# EAGLE schematic A10kalsch (EAGLE 6.5.0)
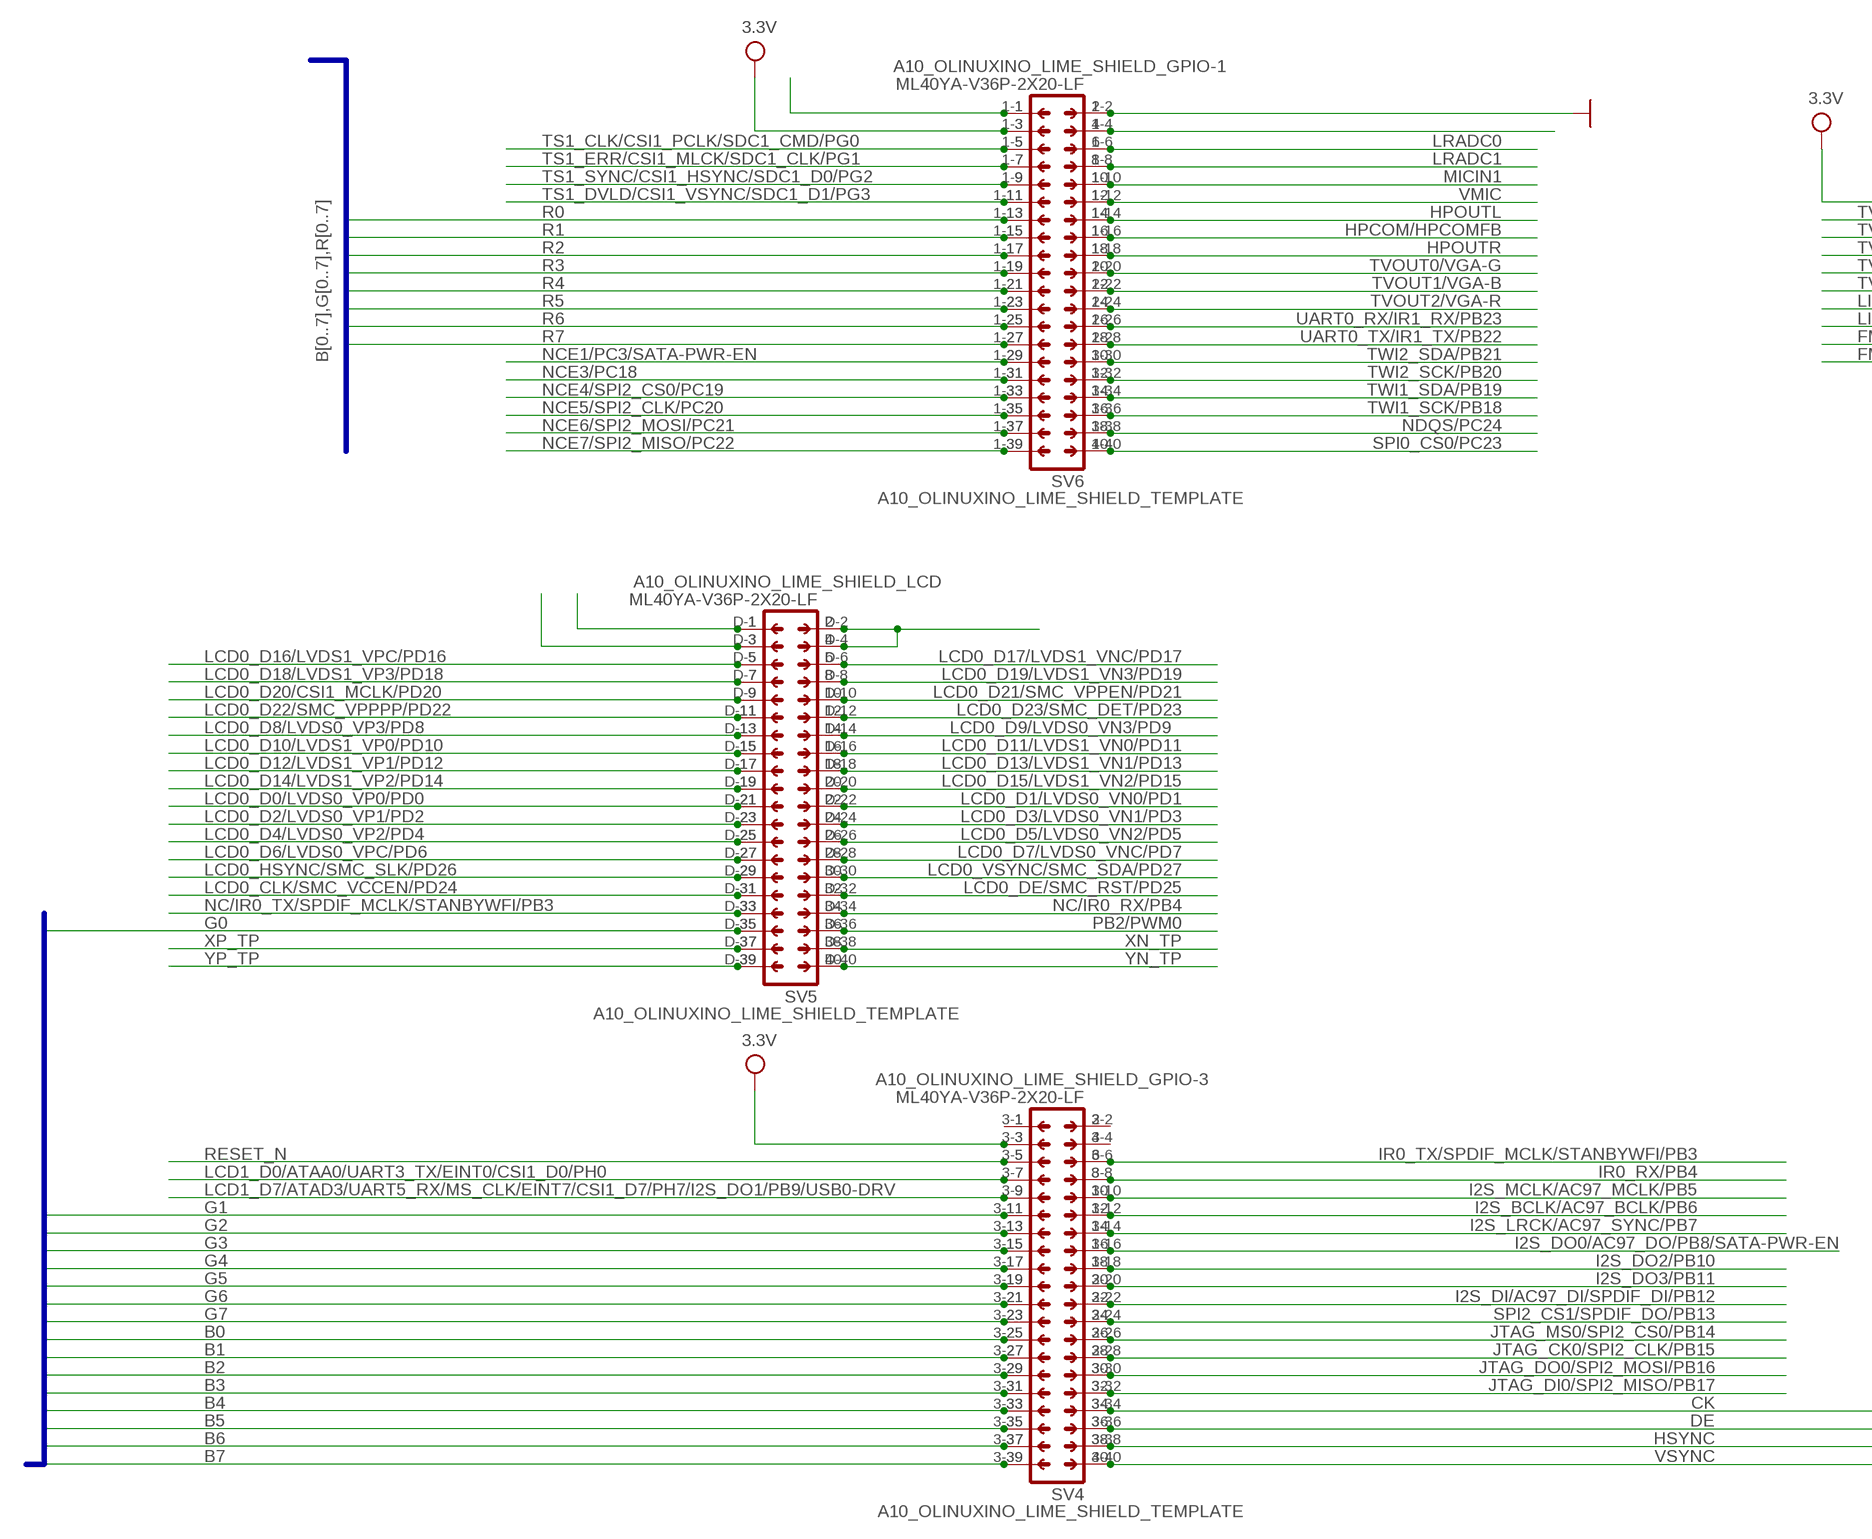
[diagram p0: schematic, sheet 1, part 1 of 2]
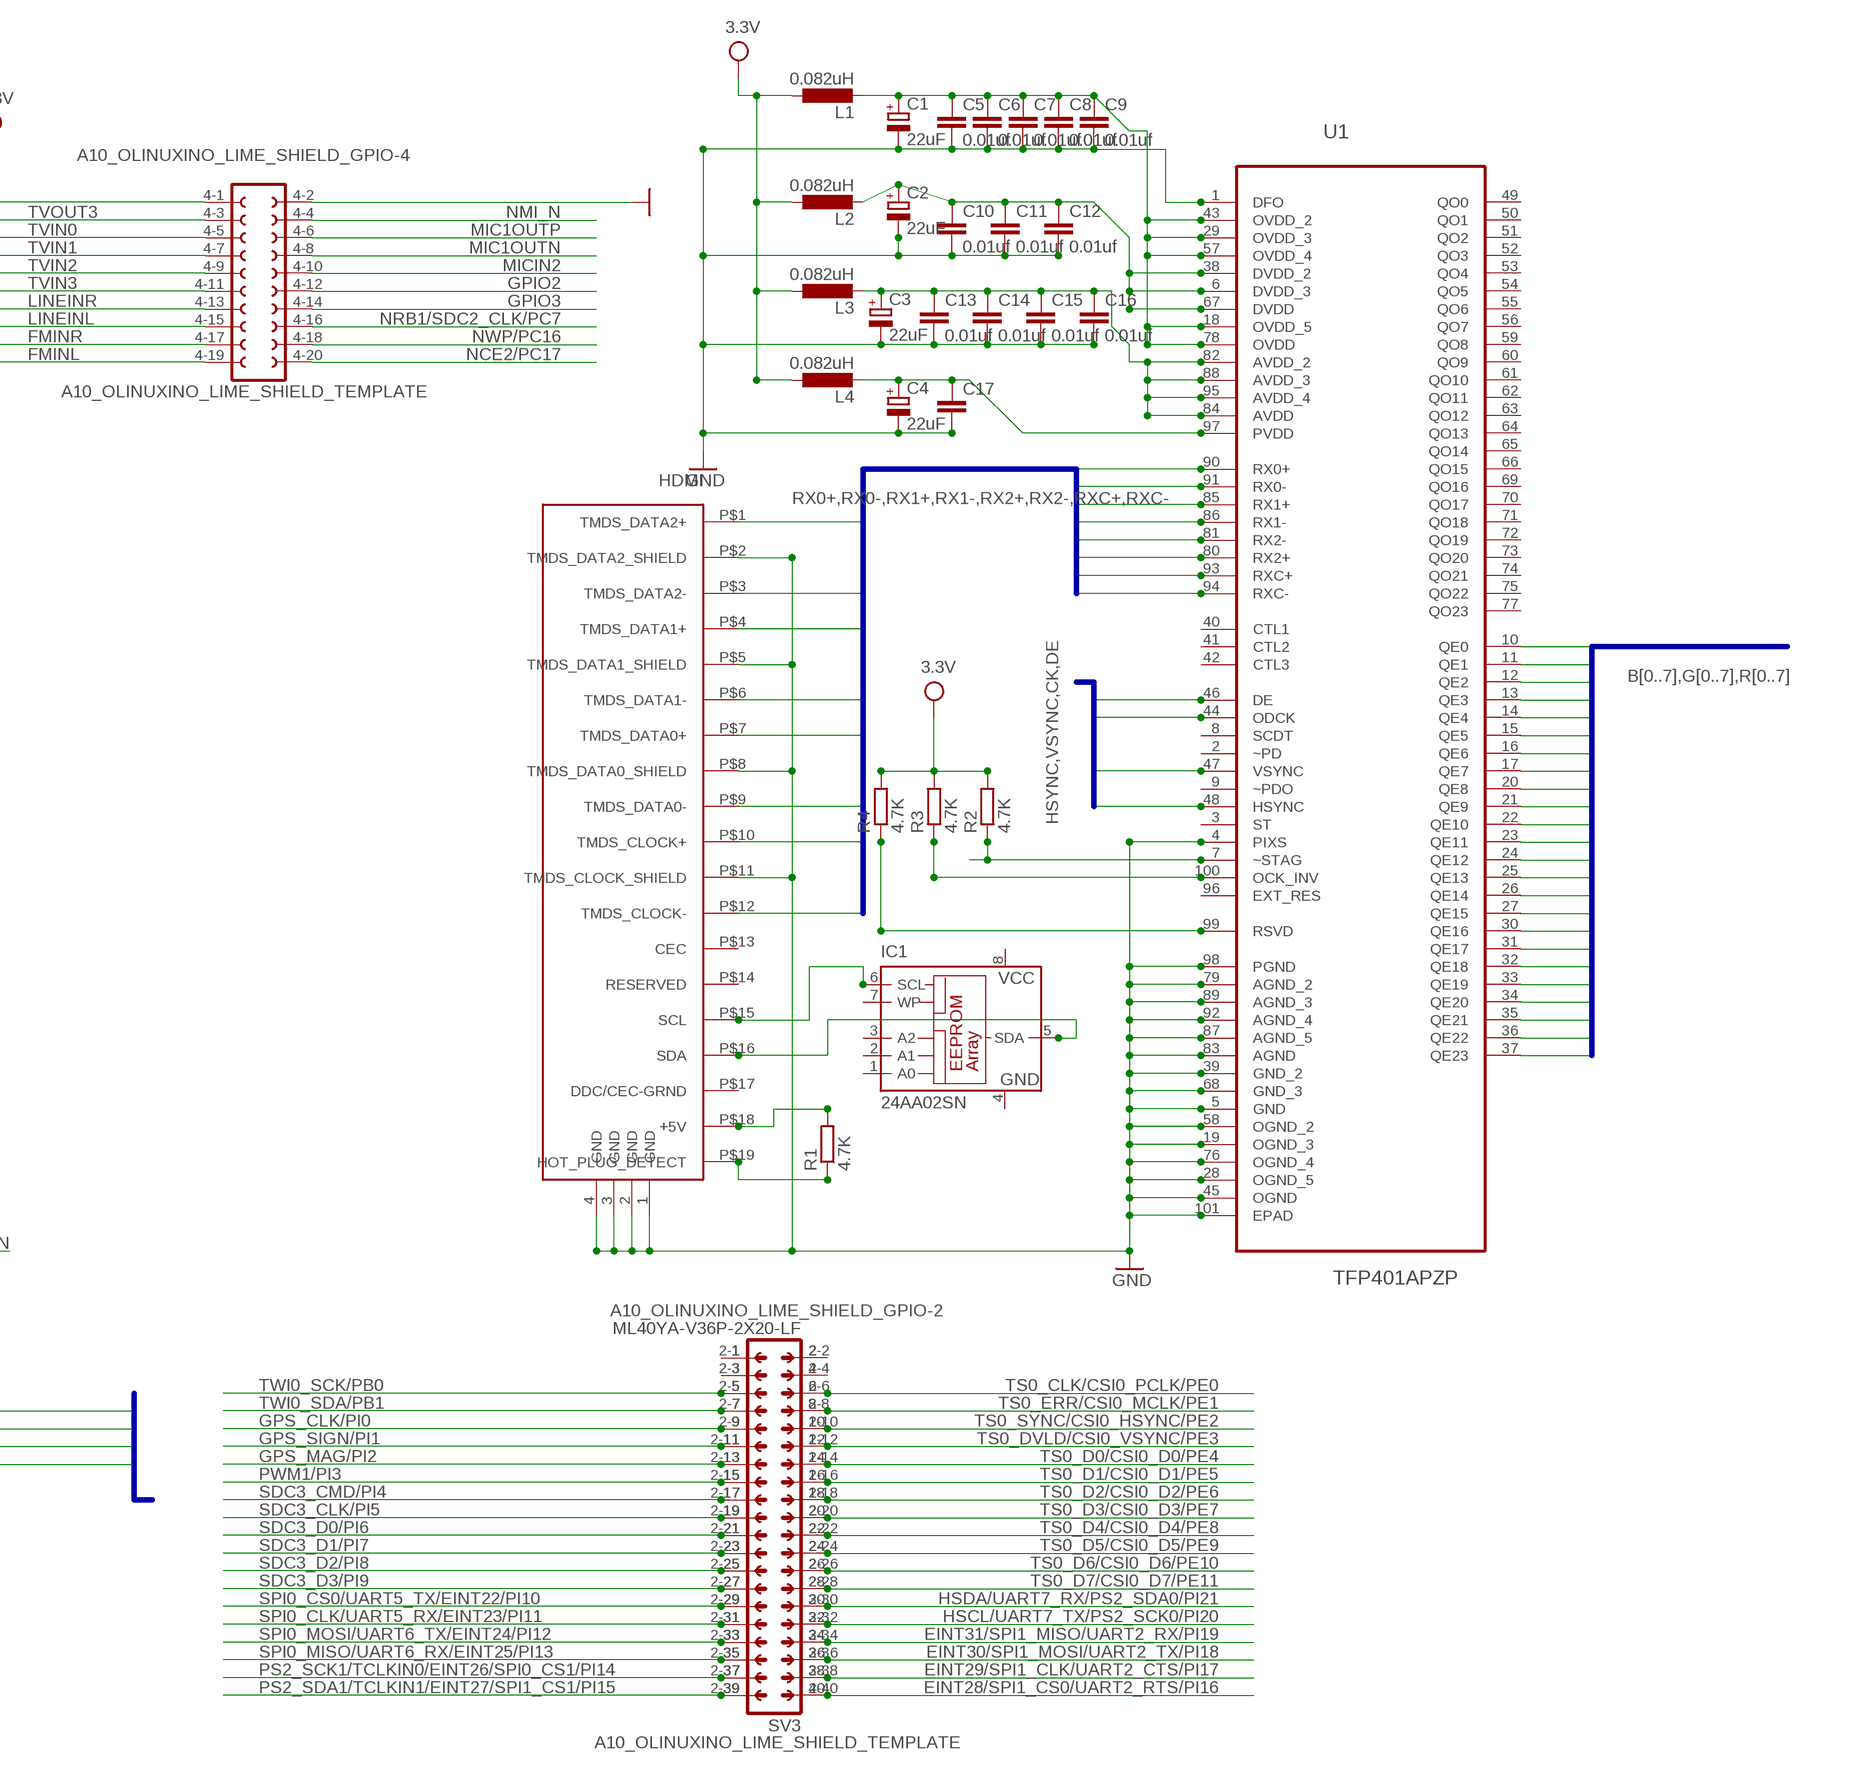
[diagram p1: schematic, sheet 1, part 2 of 2]

## Parts
A10_OLINUXINO_LIME_SHIELD  A10_OLINUXINO_LIME_SHIELD_TEMPLATE  [A10_OLINUXINO_LIME_SHIELD]
C1  22uF  CPOL-EUCT3216  [CT3216]
C2  22uF  CPOL-EUCT3216  [CT3216]
C3  22uF  CPOL-EUCT3216  [CT3216]
C4  22uF  CPOL-EUCT3216  [CT3216]
C5  0.01uf  C-EUC0402  [C0402]
C6  0.01uf  C-EUC0402  [C0402]
C7  0.01uf  C-EUC0402  [C0402]
C8  0.01uf  C-EUC0402  [C0402]
C9  0.01uf  C-EUC0402  [C0402]
C10  0.01uf  C-EUC0402  [C0402]
C11  0.01uf  C-EUC0402  [C0402]
C12  0.01uf  C-EUC0402  [C0402]
C13  0.01uf  C-EUC0402  [C0402]
C14  0.01uf  C-EUC0402  [C0402]
C15  0.01uf  C-EUC0402  [C0402]
C16  0.01uf  C-EUC0402  [C0402]
C17  C-EUC0402  [C0402]
HDMI  HDMI  [FCI-HDMI]
IC1  24AA02SN  [SO-08]
L1  0.082uH  L-EUL2012C  [L2012C]
L2  0.082uH  L-EUL2012C  [L2012C]
L3  0.082uH  L-EUL2012C  [L2012C]
L4  0.082uH  L-EUL2012C  [L2012C]
R1  4.7K  R-EU_R0603  [R0603]
R2  4.7K  R-EU_R0603  [R0603]
R3  4.7K  R-EU_R0603  [R0603]
R4  4.7K  R-EU_R0603  [R0603]
SV3  ML40YA-V36P-2X20-LF  [YA-V36P-2X20-LF]
SV4  ML40YA-V36P-2X20-LF  [YA-V36P-2X20-LF]
SV5  ML40YA-V36P-2X20-LF  [YA-V36P-2X20-LF]
SV6  ML40YA-V36P-2X20-LF  [YA-V36P-2X20-LF]
U1  TFP401APZP  [QFP50P1600X1600X120-101N]

## Nets
B0: A10_OLINUXINO_LIME_SHIELD.3-25 SV4.25 U1.10(QE0)
B1: A10_OLINUXINO_LIME_SHIELD.3-27 SV4.27 U1.11(QE1)
B2: A10_OLINUXINO_LIME_SHIELD.3-29 SV4.29 U1.12(QE2)
B3: A10_OLINUXINO_LIME_SHIELD.3-31 SV4.31 U1.13(QE3)
B4: A10_OLINUXINO_LIME_SHIELD.3-33 SV4.33 U1.14(QE4)
B5: A10_OLINUXINO_LIME_SHIELD.3-35 SV4.35 U1.15(QE5)
B6: A10_OLINUXINO_LIME_SHIELD.3-37 SV4.37 U1.16(QE6)
B7: A10_OLINUXINO_LIME_SHIELD.3-39 SV4.39 U1.17(QE7)
CK: A10_OLINUXINO_LIME_SHIELD.3-34 SV4.34 U1.44(ODCK)
DE: A10_OLINUXINO_LIME_SHIELD.3-36 SV4.36 U1.46(DE)
EINT28/SPI1_CS0/UART2_RTS/PI16: A10_OLINUXINO_LIME_SHIELD.2-40 SV3.40
EINT29/SPI1_CLK/UART2_CTS/PI17: A10_OLINUXINO_LIME_SHIELD.2-38 SV3.38
EINT30/SPI1_MOSI/UART2_TX/PI18: A10_OLINUXINO_LIME_SHIELD.2-36 SV3.36
EINT31/SPI1_MISO/UART2_RX/PI19: A10_OLINUXINO_LIME_SHIELD.2-34 SV3.34
FMINL: A10_OLINUXINO_LIME_SHIELD.4-19
FMINR: A10_OLINUXINO_LIME_SHIELD.4-17
G0: A10_OLINUXINO_LIME_SHIELD.D-35 SV5.35 U1.20(QE8)
G1: A10_OLINUXINO_LIME_SHIELD.3-11 SV4.11 U1.21(QE9)
G2: A10_OLINUXINO_LIME_SHIELD.3-13 SV4.13 U1.22(QE10)
G3: A10_OLINUXINO_LIME_SHIELD.3-15 SV4.15 U1.23(QE11)
G4: A10_OLINUXINO_LIME_SHIELD.3-17 SV4.17 U1.24(QE12)
G5: A10_OLINUXINO_LIME_SHIELD.3-19 SV4.19 U1.25(QE13)
G6: A10_OLINUXINO_LIME_SHIELD.3-21 SV4.21 U1.26(QE14)
G7: A10_OLINUXINO_LIME_SHIELD.3-23 SV4.23 U1.27(QE15)
GND: A10_OLINUXINO_LIME_SHIELD.1-2 A10_OLINUXINO_LIME_SHIELD.4-2 C1.- C2.- C3.- C4.- C5.2 C6.2 C7.2 C8.2 C9.2 C10.2 C11.2 C12.2 C13.2 C14.2 C15.2 C16.2 C17.2 HDMI.1(GND) HDMI.2(GND) HDMI.3(GND) HDMI.4(GND) HDMI.P$2(TMDS_DATA2_SHIELD) HDMI.P$5(TMDS_DATA1_SHIELD) HDMI.P$8(TMDS_DATA0_SHIELD) HDMI.P$11(TMDS_CLOCK_SHIELD) SV6.2 U1.1(DFO) U1.4(PIXS) U1.5(GND) U1.19(OGND_3) U1.28(OGND_5) U1.39(GND_2) U1.45(OGND) U1.58(OGND_2) U1.68(GND_3) U1.76(OGND_4) U1.79(AGND_2) U1.83(AGND) U1.87(AGND_5) U1.89(AGND_3) U1.92(AGND_4) U1.98(PGND) U1.101(EPAD)
GPIO2: A10_OLINUXINO_LIME_SHIELD.4-12
GPIO3: A10_OLINUXINO_LIME_SHIELD.4-14
GPS_CLK/PI0: A10_OLINUXINO_LIME_SHIELD.2-9 SV3.9
GPS_MAG/PI2: A10_OLINUXINO_LIME_SHIELD.2-13 SV3.13
GPS_SIGN/PI1: A10_OLINUXINO_LIME_SHIELD.2-11 SV3.11
HPCOM/HPCOMFB: A10_OLINUXINO_LIME_SHIELD.1-16 SV6.16
HPOUTL: A10_OLINUXINO_LIME_SHIELD.1-14 SV6.14
HPOUTR: A10_OLINUXINO_LIME_SHIELD.1-18 SV6.18
HSCL/UART7_TX/PS2_SCK0/PI20: A10_OLINUXINO_LIME_SHIELD.2-32 SV3.32
HSDA/UART7_RX/PS2_SDA0/PI21: A10_OLINUXINO_LIME_SHIELD.2-30 SV3.30
HSYNC: A10_OLINUXINO_LIME_SHIELD.3-38 SV4.38 U1.48(HSYNC)
I2S_BCLK/AC97_BCLK/PB6: A10_OLINUXINO_LIME_SHIELD.3-12 SV4.12
I2S_DI/AC97_DI/SPDIF_DI/PB12: A10_OLINUXINO_LIME_SHIELD.3-22 SV4.22
I2S_DO0/AC97_DO/PB8/SATA-PWR-EN: A10_OLINUXINO_LIME_SHIELD.3-16 SV4.16
I2S_DO2/PB10: A10_OLINUXINO_LIME_SHIELD.3-18 SV4.18
I2S_DO3/PB11: A10_OLINUXINO_LIME_SHIELD.3-20 SV4.20
I2S_LRCK/AC97_SYNC/PB7: A10_OLINUXINO_LIME_SHIELD.3-14 SV4.14
I2S_MCLK/AC97_MCLK/PB5: A10_OLINUXINO_LIME_SHIELD.3-10 SV4.10
IR0_RX/PB4: A10_OLINUXINO_LIME_SHIELD.3-8 SV4.8
IR0_TX/SPDIF_MCLK/STANBYWFI/PB3: A10_OLINUXINO_LIME_SHIELD.3-6 SV4.6
JTAG_CK0/SPI2_CLK/PB15: A10_OLINUXINO_LIME_SHIELD.3-28 SV4.28
JTAG_DI0/SPI2_MISO/PB17: A10_OLINUXINO_LIME_SHIELD.3-32 SV4.32
JTAG_DO0/SPI2_MOSI/PB16: A10_OLINUXINO_LIME_SHIELD.3-30 SV4.30
JTAG_MS0/SPI2_CS0/PB14: A10_OLINUXINO_LIME_SHIELD.3-26 SV4.26
LCD0_CLK/SMC_VCCEN/PD24: A10_OLINUXINO_LIME_SHIELD.D-31 SV5.31
LCD0_D0/LVDS0_VP0/PD0: A10_OLINUXINO_LIME_SHIELD.D-21 SV5.21
LCD0_D1/LVDS0_VN0/PD1: A10_OLINUXINO_LIME_SHIELD.D-22 SV5.22
LCD0_D2/LVDS0_VP1/PD2: A10_OLINUXINO_LIME_SHIELD.D-23 SV5.23
LCD0_D3/LVDS0_VN1/PD3: A10_OLINUXINO_LIME_SHIELD.D-24 SV5.24
LCD0_D4/LVDS0_VP2/PD4: A10_OLINUXINO_LIME_SHIELD.D-25 SV5.25
LCD0_D5/LVDS0_VN2/PD5: A10_OLINUXINO_LIME_SHIELD.D-26 SV5.26
LCD0_D6/LVDS0_VPC/PD6: A10_OLINUXINO_LIME_SHIELD.D-27 SV5.27
LCD0_D7/LVDS0_VNC/PD7: A10_OLINUXINO_LIME_SHIELD.D-28 SV5.28
LCD0_D8/LVDS0_VP3/PD8: A10_OLINUXINO_LIME_SHIELD.D-13 SV5.13
LCD0_D9/LVDS0_VN3/PD9: A10_OLINUXINO_LIME_SHIELD.D-14 SV5.14
LCD0_D10/LVDS1_VP0/PD10: A10_OLINUXINO_LIME_SHIELD.D-15 SV5.15
LCD0_D11/LVDS1_VN0/PD11: A10_OLINUXINO_LIME_SHIELD.D-16 SV5.16
LCD0_D12/LVDS1_VP1/PD12: A10_OLINUXINO_LIME_SHIELD.D-17 SV5.17
LCD0_D13/LVDS1_VN1/PD13: A10_OLINUXINO_LIME_SHIELD.D-18 SV5.18
LCD0_D14/LVDS1_VP2/PD14: A10_OLINUXINO_LIME_SHIELD.D-19 SV5.19
LCD0_D15/LVDS1_VN2/PD15: A10_OLINUXINO_LIME_SHIELD.D-20 SV5.20
LCD0_D16/LVDS1_VPC/PD16: A10_OLINUXINO_LIME_SHIELD.D-5 SV5.5
LCD0_D17/LVDS1_VNC/PD17: A10_OLINUXINO_LIME_SHIELD.D-6 SV5.6
LCD0_D18/LVDS1_VP3/PD18: A10_OLINUXINO_LIME_SHIELD.D-7 SV5.7
LCD0_D19/LVDS1_VN3/PD19: A10_OLINUXINO_LIME_SHIELD.D-8 SV5.8
LCD0_D20/CSI1_MCLK/PD20: A10_OLINUXINO_LIME_SHIELD.D-9 SV5.9
LCD0_D21/SMC_VPPEN/PD21: A10_OLINUXINO_LIME_SHIELD.D-10 SV5.10
LCD0_D22/SMC_VPPPP/PD22: A10_OLINUXINO_LIME_SHIELD.D-11 SV5.11
LCD0_D23/SMC_DET/PD23: A10_OLINUXINO_LIME_SHIELD.D-12 SV5.12
LCD0_DE/SMC_RST/PD25: A10_OLINUXINO_LIME_SHIELD.D-32 SV5.32
LCD0_HSYNC/SMC_SLK/PD26: A10_OLINUXINO_LIME_SHIELD.D-29 SV5.29
LCD0_VSYNC/SMC_SDA/PD27: A10_OLINUXINO_LIME_SHIELD.D-30 SV5.30
LCD1_D0/ATAA0/UART3_TX/EINT0/CSI1_D0/PH0: A10_OLINUXINO_LIME_SHIELD.3-7 SV4.7
LCD1_D7/ATAD3/UART5_RX/MS_CLK/EINT7/CSI1_D7/PH7/I2S_DO1/PB9/USB0-DRV: A10_OLINUXINO_LIME_SHIELD.3-9 SV4.9
LINEINL: A10_OLINUXINO_LIME_SHIELD.4-15
LINEINR: A10_OLINUXINO_LIME_SHIELD.4-13
LRADC0: A10_OLINUXINO_LIME_SHIELD.1-6 SV6.6
LRADC1: A10_OLINUXINO_LIME_SHIELD.1-8 SV6.8
MIC1OUTN: A10_OLINUXINO_LIME_SHIELD.4-8
MIC1OUTP: A10_OLINUXINO_LIME_SHIELD.4-6
MICIN1: A10_OLINUXINO_LIME_SHIELD.1-10 SV6.10
MICIN2: A10_OLINUXINO_LIME_SHIELD.4-10
N$1: A10_OLINUXINO_LIME_SHIELD.1-4 SV6.4
N$2: R2.1 U1.7(~STAG)
N$3: R3.1 U1.100(OCK_INV)
N$4: R4.1 U1.99(RSVD)
N$5: A10_OLINUXINO_LIME_SHIELD.D-3 SV5.3
N$6: C2.+ C10.1 C11.1 C12.1 L2.2 U1.6(DVDD_3) U1.38(DVDD_2) U1.67(DVDD)
N$7: C4.+ C17.1 L4.2 U1.97(PVDD)
N$8: C3.+ C13.1 C14.1 C15.1 C16.1 L3.2 U1.82(AVDD_2) U1.84(AVDD) U1.88(AVDD_3) U1.95(AVDD_4)
N$9: C1.+ C5.1 C6.1 C7.1 C8.1 C9.1 L1.2 U1.18(OVDD_5) U1.29(OVDD_3) U1.43(OVDD_2) U1.57(OVDD_4) U1.78(OVDD)
N$10: A10_OLINUXINO_LIME_SHIELD.D-1 SV5.1
N$11: A10_OLINUXINO_LIME_SHIELD.D-2 A10_OLINUXINO_LIME_SHIELD.D-4 SV5.2 SV5.4
N$15: A10_OLINUXINO_LIME_SHIELD.1-1 SV6.1
N$16: HDMI.P$18(+5V) R1.2
N$17: HDMI.P$19(HOT_PLUG_DETECT) R1.1
N$19: A10_OLINUXINO_LIME_SHIELD.2-1 SV3.1
N$20: A10_OLINUXINO_LIME_SHIELD.2-2 SV3.2
N$21: A10_OLINUXINO_LIME_SHIELD.2-3 SV3.3
N$22: A10_OLINUXINO_LIME_SHIELD.2-4 SV3.4
N$23: A10_OLINUXINO_LIME_SHIELD.3-1 SV4.1
N$24: A10_OLINUXINO_LIME_SHIELD.3-2 SV4.2
N$25: A10_OLINUXINO_LIME_SHIELD.3-4 SV4.4
N$27: HDMI.P$15(SCL) IC1.6(SCL)
N$28: HDMI.P$16(SDA) IC1.5(SDA)
NC/IR0_RX/PB4: A10_OLINUXINO_LIME_SHIELD.D-34 SV5.34
NC/IR0_TX/SPDIF_MCLK/STANBYWFI/PB3: A10_OLINUXINO_LIME_SHIELD.D-33 SV5.33
NCE1/PC3/SATA-PWR-EN: A10_OLINUXINO_LIME_SHIELD.1-29 SV6.29
NCE2/PC17: A10_OLINUXINO_LIME_SHIELD.4-20
NCE3/PC18: A10_OLINUXINO_LIME_SHIELD.1-31 SV6.31
NCE4/SPI2_CS0/PC19: A10_OLINUXINO_LIME_SHIELD.1-33 SV6.33
NCE5/SPI2_CLK/PC20: A10_OLINUXINO_LIME_SHIELD.1-35 SV6.35
NCE6/SPI2_MOSI/PC21: A10_OLINUXINO_LIME_SHIELD.1-37 SV6.37
NCE7/SPI2_MISO/PC22: A10_OLINUXINO_LIME_SHIELD.1-39 SV6.39
NDQS/PC24: A10_OLINUXINO_LIME_SHIELD.1-38 SV6.38
NMI_N: A10_OLINUXINO_LIME_SHIELD.4-4
NRB1/SDC2_CLK/PC7: A10_OLINUXINO_LIME_SHIELD.4-16
NWP/PC16: A10_OLINUXINO_LIME_SHIELD.4-18
PB2/PWM0: A10_OLINUXINO_LIME_SHIELD.D-36 SV5.36
PS2_SCK1/TCLKIN0/EINT26/SPI0_CS1/PI14: A10_OLINUXINO_LIME_SHIELD.2-37 SV3.37
PS2_SDA1/TCLKIN1/EINT27/SPI1_CS1/PI15: A10_OLINUXINO_LIME_SHIELD.2-39 SV3.39
PWM1/PI3: A10_OLINUXINO_LIME_SHIELD.2-15 SV3.15
R0: A10_OLINUXINO_LIME_SHIELD.1-13 SV6.13 U1.30(QE16)
R1: A10_OLINUXINO_LIME_SHIELD.1-15 SV6.15 U1.31(QE17)
R2: A10_OLINUXINO_LIME_SHIELD.1-17 SV6.17 U1.32(QE18)
R3: A10_OLINUXINO_LIME_SHIELD.1-19 SV6.19 U1.33(QE19)
R4: A10_OLINUXINO_LIME_SHIELD.1-21 SV6.21 U1.34(QE20)
R5: A10_OLINUXINO_LIME_SHIELD.1-23 SV6.23 U1.35(QE21)
R6: A10_OLINUXINO_LIME_SHIELD.1-25 SV6.25 U1.36(QE22)
R7: A10_OLINUXINO_LIME_SHIELD.1-27 SV6.27 U1.37(QE23)
RESET_N: A10_OLINUXINO_LIME_SHIELD.3-5 SV4.5
RX0_N: HDMI.P$9(TMDS_DATA0-) U1.91(RX0-)
RX0_P: HDMI.P$7(TMDS_DATA0+) U1.90(RX0+)
RX1_N: HDMI.P$6(TMDS_DATA1-) U1.86(RX1-)
RX1_P: HDMI.P$4(TMDS_DATA1+) U1.85(RX1+)
RX2_N: HDMI.P$3(TMDS_DATA2-) U1.81(RX2-)
RX2_P: HDMI.P$1(TMDS_DATA2+) U1.80(RX2+)
RXC_N: HDMI.P$12(TMDS_CLOCK-) U1.94(RXC-)
RXC_P: HDMI.P$10(TMDS_CLOCK+) U1.93(RXC+)
SDC3_CLK/PI5: A10_OLINUXINO_LIME_SHIELD.2-19 SV3.19
SDC3_CMD/PI4: A10_OLINUXINO_LIME_SHIELD.2-17 SV3.17
SDC3_D0/PI6: A10_OLINUXINO_LIME_SHIELD.2-21 SV3.21
SDC3_D1/PI7: A10_OLINUXINO_LIME_SHIELD.2-23 SV3.23
SDC3_D2/PI8: A10_OLINUXINO_LIME_SHIELD.2-25 SV3.25
SDC3_D3/PI9: A10_OLINUXINO_LIME_SHIELD.2-27 SV3.27
SPI0_CLK/UART5_RX/EINT23/PI11: A10_OLINUXINO_LIME_SHIELD.2-31 SV3.31
SPI0_CS0/PC23: A10_OLINUXINO_LIME_SHIELD.1-40 SV6.40
SPI0_CS0/UART5_TX/EINT22/PI10: A10_OLINUXINO_LIME_SHIELD.2-29 SV3.29
SPI0_MISO/UART6_RX/EINT25/PI13: A10_OLINUXINO_LIME_SHIELD.2-35 SV3.35
SPI0_MOSI/UART6_TX/EINT24/PI12: A10_OLINUXINO_LIME_SHIELD.2-33 SV3.33
SPI2_CS1/SPDIF_DO/PB13: A10_OLINUXINO_LIME_SHIELD.3-24 SV4.24
TS0_CLK/CSI0_PCLK/PE0: A10_OLINUXINO_LIME_SHIELD.2-6 SV3.6
TS0_D0/CSI0_D0/PE4: A10_OLINUXINO_LIME_SHIELD.2-14 SV3.14
TS0_D1/CSI0_D1/PE5: A10_OLINUXINO_LIME_SHIELD.2-16 SV3.16
TS0_D2/CSI0_D2/PE6: A10_OLINUXINO_LIME_SHIELD.2-18 SV3.18
TS0_D3/CSI0_D3/PE7: A10_OLINUXINO_LIME_SHIELD.2-20 SV3.20
TS0_D4/CSI0_D4/PE8: A10_OLINUXINO_LIME_SHIELD.2-22 SV3.22
TS0_D5/CSI0_D5/PE9: A10_OLINUXINO_LIME_SHIELD.2-24 SV3.24
TS0_D6/CSI0_D6/PE10: A10_OLINUXINO_LIME_SHIELD.2-26 SV3.26
TS0_D7/CSI0_D7/PE11: A10_OLINUXINO_LIME_SHIELD.2-28 SV3.28
TS0_DVLD/CSI0_VSYNC/PE3: A10_OLINUXINO_LIME_SHIELD.2-12 SV3.12
TS0_ERR/CSI0_MCLK/PE1: A10_OLINUXINO_LIME_SHIELD.2-8 SV3.8
TS0_SYNC/CSI0_HSYNC/PE2: A10_OLINUXINO_LIME_SHIELD.2-10 SV3.10
TS1_CLK/CSI1_PCLK/SDC1_CMD/PG0: A10_OLINUXINO_LIME_SHIELD.1-5 SV6.5
TS1_DVLD/CSI1_VSYNC/SDC1_D1/PG3: A10_OLINUXINO_LIME_SHIELD.1-11 SV6.11
TS1_ERR/CSI1_MLCK/SDC1_CLK/PG1: A10_OLINUXINO_LIME_SHIELD.1-7 SV6.7
TS1_SYNC/CSI1_HSYNC/SDC1_D0/PG2: A10_OLINUXINO_LIME_SHIELD.1-9 SV6.9
TVIN0: A10_OLINUXINO_LIME_SHIELD.4-5
TVIN1: A10_OLINUXINO_LIME_SHIELD.4-7
TVIN2: A10_OLINUXINO_LIME_SHIELD.4-9
TVIN3: A10_OLINUXINO_LIME_SHIELD.4-11
TVOUT0/VGA-G: A10_OLINUXINO_LIME_SHIELD.1-20 SV6.20
TVOUT1/VGA-B: A10_OLINUXINO_LIME_SHIELD.1-22 SV6.22
TVOUT2/VGA-R: A10_OLINUXINO_LIME_SHIELD.1-24 SV6.24
TVOUT3: A10_OLINUXINO_LIME_SHIELD.4-3
TWI0_SCK/PB0: A10_OLINUXINO_LIME_SHIELD.2-5 SV3.5
TWI0_SDA/PB1: A10_OLINUXINO_LIME_SHIELD.2-7 SV3.7
TWI1_SCK/PB18: A10_OLINUXINO_LIME_SHIELD.1-36 SV6.36
TWI1_SDA/PB19: A10_OLINUXINO_LIME_SHIELD.1-34 SV6.34
TWI2_SCK/PB20: A10_OLINUXINO_LIME_SHIELD.1-32 SV6.32
TWI2_SDA/PB21: A10_OLINUXINO_LIME_SHIELD.1-30 SV6.30
UART0_RX/IR1_RX/PB23: A10_OLINUXINO_LIME_SHIELD.1-26 SV6.26
UART0_TX/IR1_TX/PB22: A10_OLINUXINO_LIME_SHIELD.1-28 SV6.28
VCC: A10_OLINUXINO_LIME_SHIELD.1-3 A10_OLINUXINO_LIME_SHIELD.3-3 A10_OLINUXINO_LIME_SHIELD.4-1 L1.1 L2.1 L3.1 L4.1 R2.2 R3.2 R4.2 SV4.3 SV6.3 ; supply symbol labelled 3.3V
VMIC: A10_OLINUXINO_LIME_SHIELD.1-12 SV6.12
VSYNC: A10_OLINUXINO_LIME_SHIELD.3-40 SV4.40 U1.47(VSYNC)
XN_TP: A10_OLINUXINO_LIME_SHIELD.D-38 SV5.38
XP_TP: A10_OLINUXINO_LIME_SHIELD.D-37 SV5.37
YN_TP: A10_OLINUXINO_LIME_SHIELD.D-40 SV5.40
YP_TP: A10_OLINUXINO_LIME_SHIELD.D-39 SV5.39
Unconnected: HDMI.P$13(CEC) HDMI.P$14(RESERVED) HDMI.P$17(DDC/CEC-GRND) IC1.1(A0) IC1.2(A1) IC1.3(A2) IC1.7(WP) U1.2(~PD) U1.3(ST) U1.8(SCDT) U1.9(~PDO) U1.40(CTL1) U1.41(CTL2) U1.42(CTL3) U1.49(QO0) U1.50(QO1) U1.51(QO2) U1.52(QO3) U1.53(QO4) U1.54(QO5) U1.55(QO6) U1.56(QO7) U1.59(QO8) U1.60(QO9) U1.61(QO10) U1.62(QO11) U1.63(QO12) U1.64(QO13) U1.65(QO14) U1.66(QO15) U1.69(QO16) U1.70(QO17) U1.71(QO18) U1.72(QO19) U1.73(QO20) U1.74(QO21) U1.75(QO22) U1.77(QO23) U1.96(EXT_RES)

## Buses
B[0..7],G[0..7],R[0..7]
HSYNC,VSYNC,CK,DE
RX0+,RX0-,RX1+,RX1-,RX2+,RX2-,RXC+,RXC-

## Power pins joined to a net without a drawn wire
GND: IC1.4(GND)
VCC: IC1.8(VCC)

## Library data of the parts
A10_OLINUXINO_LIME_SHIELD = A10_OLIMEXINO_LIME_SHIELD:A10_OLINUXINO_LIME_SHIELD_TEMPLATE
C1-C4 = resistor:CPOL-EU: POLARIZED CAPACITOR, European symbol
C5-C17 = resistor:C-EU: CAPACITOR, European symbol
HDMI = hdmi:HDMI
IC1 = microchip:24*: Serial EEPROM I2C; MPN: 24AA02/SN; OC_FARNELL: 1331272; OC_NEWARK: 89C9793
L1-L4 = rcl:L-EU: INDUCTOR, European symbol
R1-R4 = rcl:R-EU_: RESISTOR, European symbol
SV3-SV6 = OLIMEX_CASES:ML40: HARTING
U1 = ti-tfp401:TFP401APZP: DIGITAL RECEIVER; MPN: TFP401APZP; OC_FARNELL: 1470430; OC_NEWARK: 74K3959; PACKAGE: QFP-100; SUPPLIER: TEXAS INSTRUMENTS